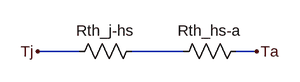
[diagram p0: schematic united.asc]
united.asc, the LTspice schematic file:
Version 4
SHEET 1 880 908
WIRE 128 512 64 512
WIRE 288 512 208 512
WIRE 400 512 368 512
FLAG 64 512 Tj
FLAG 400 512 Ta
SYMBOL res 224 496 R90
WINDOW 0 0 56 VBottom 2
WINDOW 3 32 56 VTop 2
SYMATTR InstName Rth_j-hs
SYMATTR Value ""
SYMBOL res 384 496 R90
WINDOW 0 0 56 VBottom 2
WINDOW 3 32 56 VTop 2
SYMATTR InstName Rth_hs-a
SYMATTR Value ""

The netlist it stands for:
* united.asc
Rth_j-hs N001 Tj
Rth_hs-a Ta N001
.backanno
.end